# Altium schematic sheet PM12_P1V8.SchDoc: FIT_PM12 board
size 420 x 297 mm; CheckedBy: G.Kasprowicz; Author: INR Moscow; CompanyName: WUT ISE; DrawnBy: M.Podgórski; Organization: WUT ISE; Address1: PW ISE; Address2: Nowowiejska 15/19 00-665 Warsaw; Address3: gkasprow@gmail.com; DocumentNumber: 20; Revision: 2; SheetNumber: 21; SheetTotal: 34; ModifiedBy: -; CheckedDate: -; Title2: P1V8 PSU; DivGrp: WUT ISE; Designer: INR RAS; ModifiedDate: -; ProjectName: Sensor Box
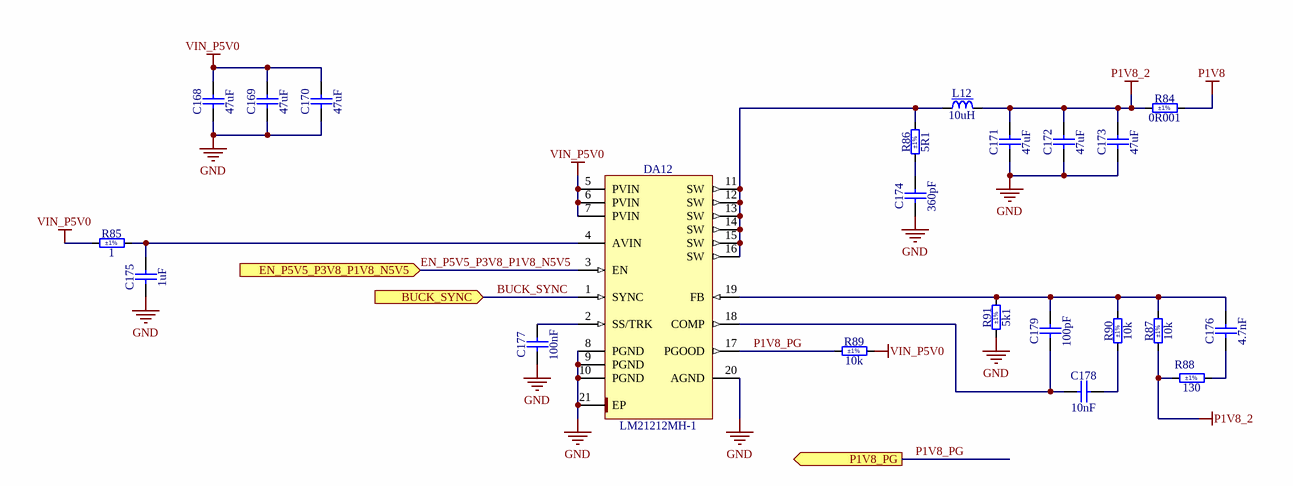
[diagram p0: PM12_P1V8.SchDoc]

## Parts
C168  47uF  [CAPC3225X270N]
C169  47uF  [CAPC3225X270N]
C170  47uF  [CAPC3225X270N]
C171  47uF  [CAPC3225X270N]
C172  47uF  [CAPC3225X270N]
C173  47uF  [CAPC3225X270N]
C174  360pF  [CAPC2013X145N]
C175  1uF  [CAPC2012X140N]
C176  4.7nF  [CAPC2012X135N]
C177  100nF  [CAPC2012X135N]
C178  10nF  [CAPC2012X135N]
C179  100pF  [CAPC2012X135N]
DA12  LM21212MH-1  [TEXAS_PWP0020AA]
L12  10uH  [IND_VISHAY_IHPL4040DZ-01]
R84  0R001  Tolerance: ±1%  [RESC_BOURNS_CRE2512_0R001-0R004]
R85  1  Tolerance: ±1%  [RESC2012X60N]
R86  5R1  Tolerance: ±1%  [RESC2012X60N]
R87  10k  Tolerance: ±1%  [RESC2012X60N]
R88  130  Tolerance: ±1%  [RESC2012X60N]
R89  10k  Tolerance: ±1%  [RESC2012X60N]
R90  10k  Tolerance: ±1%  [RESC2012X60N]
R91  5k1  Tolerance: ±1%  [RESC2012X60N]

## Ports
BUCK_SYNC (in), EN_P5V5_P3V8_P1V8_N5V5 (in), P1V8_PG (out)

## Nets
GND: C168.1 C169.1 C170.1 C171.1 C172.1 C173.1 C174.1 C175.1 C177.1 DA12.8(PGND) DA12.9(PGND) DA12.10(PGND) DA12.20(AGND) DA12.21(EP) R91.1
P1V8: R84.2
P1V8_2: C171.2 C172.2 C173.2 L12.2 R84.1 R87.1 R88.2
VIN_P5V0: C168.2 C169.2 C170.2 DA12.5(PVIN) DA12.6(PVIN) DA12.7(PVIN) R85.1 R89.2
BUCK_SYNC: DA12.1(SYNC) ; port BUCK_SYNC
EN_P5V5_P3V8_P1V8_N5V5: DA12.3(EN) ; port EN_P5V5_P3V8_P1V8_N5V5
P1V8_PG: DA12.17(PGOOD) R89.1 ; port P1V8_PG
NetC174_2: C174.2 R86.1
NetC175_2: C175.2 DA12.4(AVIN) R85.2
NetC176_1: C176.1 R88.1
NetC176_2: C176.2 C179.2 DA12.19(FB) R87.2 R90.2 R91.2
NetC177_2: C177.2 DA12.2(SS/TRK)
NetC178_1: C178.1 R90.1
NetC178_2: C178.2 C179.1 DA12.18(COMP)
NetDA12_11: DA12.11(SW) DA12.12(SW) DA12.13(SW) DA12.14(SW) DA12.15(SW) DA12.16(SW) L12.1 R86.2

## Notes on the sheet
- Project/Equipment
- Document
- Designer
- Drawn by
- Check.by
- Copyright WUT ISE 2024.
  This documentation describes Open Hardware and is licensed under the CERN OHL v.2. You may redistribute and modify this documentation under the terms of the CERN OHL v.2. (http://ohwr.org/CERNOHL). This documentation is distributed WITHOUT ANY EXPRESS OR IMPLIED WARRANTY, INCLUDING OF MERCHANTABILITY, SATISFACTORY QUALITY AND FITNESS FOR A PARTICULAR PURPOSE. Please see the CERN OHL v.2 for applicable conditions.
- Contact
- File
- Last Mod.
- Print Date
- Sheet
- Size
- A3
- of
- Rev

## Library data of the parts
C168-C173 = CC1210_47UF_16V_20%_X5R: Non-polarised capacitor; Part Description: SMD Multilayer Chip Ceramic Capacitor; Manufacturer: GENERIC; Manufacturer1 Part Number: EMK325BJ476MM-T; Voltage: 16V; TC: X5R; Tolerance: ±20%; Part Number: CC1210_47UF_16V_20%_X5R; Component Kind: Standard; Component Type: Standard; Pin Count: 2; Value: 47uF; Status: None; Manufacturer Part Number: CC1210_47UF_16V_20%_X5R; Case: 1210; Mounted: Yes; Socket: No; SMD: Yes; Sense: No; Manufacturer1 Example: TAIYO YUDEN; Manufacturer1 ComponentHeight: 2.7mm; HelpURL: \\cern.ch\dfs\Applications\Altium\Datasheets\CC1210_X5R_TAIYO-YUDEN_HIGH-VALUE.pdf; Author: CERN DEM MR; CreateDate: 03.02.2016; LatestRevisionDate: 03.02.2016
C174 = CC0805_360PF_50V_5%_C0G: Non-polarised capacitor; Part Description: SMD Multilayer Chip Ceramic Capacitor; Manufacturer: GENERIC; Manufacturer1 Part Number: CC0805JRNPO9BN361; Voltage: 50V; TC: NP0; Tolerance: ±5%; Part Number: CC0805_360PF_50V_5%_C0G; Component Kind: Standard; Component Type: Standard; Pin Count: 2; Value: 360pF; Status: None; Manufacturer Part Number: CC0805_360PF_50V_5%_C0G; Case: 0805; Mounted: Yes; Socket: No; SMD: Yes; Sense: No; Manufacturer1 Example: YAGEO PHYCOMP; Manufacturer1 ComponentHeight: 1.45mm; HelpURL: \\cern.ch\dfs\Applications\Altium\Datasheets\CC0805_NP0_YAGEO.pdf; Author: CERN DEM HF; CreateDate: 30.05.2024; LatestRevisionDate: 30.05.2024
C175 = CC0805_1UF_25V_10%_X7R: Non-polarised capacitor; Part Description: SMD Multilayer Chip Ceramic Capacitor; Manufacturer: GENERIC; Manufacturer1 Part Number: C0805C105K3RAC; Voltage: 25V; TC: X7R; Tolerance: ±10%; Part Number: CC0805_1UF_25V_10%_X7R; Component Kind: Standard; Component Type: Standard; Pin Count: 2; Value: 1uF; Status: Preferred; Manufacturer Part Number: CC0805_1UF_25V_10%_X7R; Case: 0805; Mounted: Yes; Socket: No; SMD: Yes; Sense: No; Manufacturer1 Example: KEMET; Manufacturer1 ComponentHeight: 1.4mm; HelpURL: \\cern.ch\dfs\Applications\Altium\Datasheets\CC0805_X7R_KEMET.pdf; Author: CERN DEM JLC; CreateDate: 23.03.2009; LatestRevisionDate: 23.03.2009
C176 = CC0805_4.7NF_50V_10%_X7R: Non-polarised capacitor; Part Description: SMD Multilayer Chip Ceramic Capacitor; Manufacturer: GENERIC; Manufacturer1 Part Number: 223858615632; Voltage: 50V; TC: X7R; Tolerance: ±10%; Part Number: CC0805_4.7NF_50V_10%_X7R; Component Kind: Standard; Component Type: Standard; Pin Count: 2; Value: 4.7nF; Status: Preferred; Manufacturer Part Number: CC0805_4.7NF_50V_10%_X7R; Case: 0805; Mounted: Yes; Socket: No; SMD: Yes; Sense: No; Manufacturer1 Example: PHYCOMP; Manufacturer1 ComponentHeight: 0.94mm; HelpURL: \\cern.ch\dfs\Applications\Altium\Datasheets\CC0805_X7R_PHYCOMP.pdf; Author: CERN DEM JLC; CreateDate: 03.12.2007; LatestRevisionDate: 03.12.2007
C177 = CC0805_100NF_50V_10%_X7R: Non-polarised capacitor; Part Description: SMD Multilayer Chip Ceramic Capacitor; Manufacturer: GENERIC; Manufacturer1 Part Number: C2012X7R1H104K085; Voltage: 50V; TC: X7R; Tolerance: ±10%; Part Number: CC0805_100NF_50V_10%_X7R; Component Kind: Standard; Component Type: Standard; Pin Count: 2; Value: 100nF; Status: None; Manufacturer Part Number: CC0805_100NF_50V_10%_X7R; Case: 0805; Mounted: Yes; Socket: No; SMD: Yes; Sense: No; Manufacturer1 Example: TDK; Manufacturer1 ComponentHeight: 1mm; HelpURL: \\cern.ch\dfs\Applications\Altium\Datasheets\CC0805_X7R_TDK_C.pdf; Author: CERN DEM JLC; CreateDate: 03.12.2007; LatestRevisionDate: 22.04.2015
C178 = CC0805_10NF_50V_10%_X7R: Non-polarised capacitor; Part Description: SMD Multilayer Chip Ceramic Capacitor; Manufacturer: GENERIC; Manufacturer1 Part Number: C0805C103K5RACTU; Voltage: 50V; TC: X7R; Tolerance: ±10%; Part Number: CC0805_10NF_50V_10%_X7R; Component Kind: Standard; Component Type: Standard; Pin Count: 2; Value: 10nF; Status: Preferred; Manufacturer Part Number: CC0805_10NF_50V_10%_X7R; Case: 0805; Mounted: Yes; Socket: No; SMD: Yes; Sense: No; Manufacturer1 Example: KEMET; Manufacturer1 ComponentHeight: 0.88mm; HelpURL: \\cern.ch\dfs\Applications\Altium\Datasheets\CC0805_X7R_KEMET.pdf; Author: CERN DEM JLC; CreateDate: 03.12.2007; LatestRevisionDate: 22.04.2015
C179 = CC0805_100PF_50V_5%_NP0: Non-polarised capacitor; Part Description: SMD Multilayer Chip Ceramic Capacitor; Manufacturer: GENERIC; Manufacturer1 Part Number: 223886115101; Voltage: 50V; TC: C0G/NP0; Tolerance: ±5%; Part Number: CC0805_100PF_50V_5%_NP0; Component Kind: Standard; Component Type: Standard; Pin Count: 2; Value: 100pF; Status: Preferred; Manufacturer Part Number: CC0805_100PF_50V_5%_NP0; Case: 0805; Mounted: Yes; Socket: No; SMD: Yes; Sense: No; Manufacturer1 Example: PHYCOMP; Manufacturer1 ComponentHeight: 1.35mm; HelpURL: \\cern.ch\dfs\Applications\Altium\Datasheets\CC0805_NP0_PHYCOMP.pdf; Author: CERN DEM JLC; CreateDate: 03.12.2007; LatestRevisionDate: 03.12.2007
DA12 = LM21212MH-1: 2.95-V To 5.5-V, 12-A, Voltage-Mode Synchronous Buck Regulator with Frequency Synchronization; Manufacturer: TEXAS INSTRUMENTS; PressFit: No; Bonding: No; Part Number: LM21212MH-1; Component Kind: Standard; Component Type: Standard; Device: LM21212MH-1; PackageDescription: TEXAS Case Style PWP0020AA, SOP, 0.65mm Pitch; 20 Pin, 4.40mm W X 6.50mm L X 1.10mm H body (w/thermal tab 3.4mm X 4.6mm  ), IPC Medium Density; Part Description: 2.95-V To 5.5-V, 12-A, Voltage-Mode Synchronous Buck Regulator with Frequency Synchronization; Manufacturer Part Number: LM21212MH-1; Pin Count: 21; Case: TSSOP20; Mounted: Yes; Socket: No; SMD: Yes; Sense: No; ComponentHeight: 1.1mm; HelpURL: \\cern.ch\dfs\Applications\Altium\Datasheets\LM21212MH-1.pdf; Author: CERN DEM HF; CreateDate: 05.06.2024; LatestRevisionDate: 05.06.2024
L12 = IND4040_10UH_20%_VISHAY_IHLP-4040DZ-01: Inductor With Core; Part Description: IHLP® Commercial Inductor, Low DCR Series; Manufacturer: VISHAY DALE; Manufacturer Part Number: IHLP4040DZER100M01; Power: 6.8A; Resistance: 0.0332R; Tolerance: ±20%; Part Number: IND4040_10UH_20%_VISHAY_IHLP-4040DZ-01; Component Kind: Standard; Component Type: Standard; Pin Count: 2; Value: 10uH; Case: 4040; Mounted: Yes; Socket: No; SMD: Yes; Sense: No; ComponentHeight: 4mm; HelpURL: \\cern.ch\dfs\Applications\Altium\Datasheets\IND_VISHAY_IHLP4040DZ-01.pdf; Author: CERN DEM HF; CreateDate: 31.05.2024; LatestRevisionDate: 31.05.2024
R84 = R2512_0R001_1%_3W_50PPM_BOURNS_CRE2512: Resistor - 1%; Part Description: High Power Current Sense Chip Resistor; Manufacturer: BOURNS; Manufacturer Part Number: CRE2512-FZ-R001E-3; Power: 3W; TC: ±50ppm/°C; PressFit: No; Part Number: R2512_0R001_1%_3W_50PPM_BOURNS_CRE2512; Component Kind: Standard; Component Type: Standard; Pin Count: 2; Value: 0R001; Status: None; Case: 2512; Mounted: Yes; Sense: No; Socket: No; SMD: Yes; ComponentHeight: 0.9mm; HelpURL: \\cern.ch\dfs\Applications\Altium\Datasheets\R2512_BOURNS_CRE2512.pdf; Author: CERN DEM BC; CreateDate: 13.10.2021; LatestRevisionDate: 13.10.2021
R85 = R0805_1R_1%_0.125W_100PPM: Resistor - 1%; Part Description: Thick Film Chip Resistor; Manufacturer: GENERIC; Manufacturer1 Part Number: CRCW08051R00FKEA; Power: 0.125W; TC: ±100ppm/°C; PressFit: No; Part Number: R0805_1R_1%_0.125W_100PPM; Component Kind: Standard; Component Type: Standard; Pin Count: 2; Value: 1; Status: None; Manufacturer Part Number: R0805_1R_1%_0.125W_100PPM; Case: 0805; Mounted: Yes; Sense: No; Socket: No; SMD: Yes; Manufacturer1 Example: VISHAY; Manufacturer1 ComponentHeight: 0.6mm; HelpURL: \\cern.ch\dfs\Applications\Altium\Datasheets\R0805_VISHAY_CRCW e3.pdf; Author: CERN DEM HF; CreateDate: 07.06.2024; LatestRevisionDate: 07.06.2024
R86 = R0805_5R1_1%_0.125W_100PPM: Resistor - 1%; Part Description: Thick Film Chip Resistor; Manufacturer: GENERIC; Manufacturer1 Part Number: CRCW08055R10FKEAHP; Power: 0.125W; TC: ±100ppm/°C; PressFit: No; Part Number: R0805_5R1_1%_0.125W_100PPM; Component Kind: Standard; Component Type: Standard; Pin Count: 2; Value: 5R1; Status: None; Manufacturer Part Number: R0805_5R1_1%_0.125W_100PPM; Case: 0805; Mounted: Yes; Sense: No; Socket: No; SMD: Yes; Manufacturer1 Example: VISHAY; Manufacturer1 ComponentHeight: 0.6mm; HelpURL: \\cern.ch\dfs\Applications\Altium\Datasheets\R0805_VISHAY_CRCW-HP e3.pdf; Author: CERN DEM HF; CreateDate: 07.06.2024; LatestRevisionDate: 07.06.2024
R87 R89 R90 = R0805_10K_1%_0.125W_100PPM: Resistor - 1%; Part Description: General Purpose Thick Film Chip Resistor; Manufacturer: GENERIC; Manufacturer1 Part Number: NRC10F1002TRF; Power: 0.125W; TC: ±100ppm/°C; PressFit: No; Part Number: R0805_10K_1%_0.125W_100PPM; Component Kind: Standard; Component Type: Standard; Pin Count: 2; Value: 10k; Status: Preferred; Manufacturer Part Number: R0805_10K_1%_0.125W_100PPM; Case: 0805; Mounted: Yes; Sense: No; Socket: No; SMD: Yes; Manufacturer1 Example: NIC COMPONENT; Manufacturer1 ComponentHeight: 0.6mm; HelpURL: \\cern.ch\dfs\Applications\Altium\Datasheets\R0805_NIC_NRC.pdf; Author: CERN DEM JLC; CreateDate: 03.12.2007; LatestRevisionDate: 13.03.2008
R88 = R0805_130R_1%_0.125W_100PPM: Resistor - 1%; Part Description: General Purpose Thick Film Chip Resistor; Manufacturer: GENERIC; Manufacturer1 Part Number: NRC10F1300TRF; Power: 0.125W; TC: ±100ppm/°C; PressFit: No; Part Number: R0805_130R_1%_0.125W_100PPM; Component Kind: Standard; Component Type: Standard; Pin Count: 2; Value: 130; Status: Preferred; Manufacturer Part Number: R0805_130R_1%_0.125W_100PPM; Case: 0805; Mounted: Yes; Sense: No; Socket: No; SMD: Yes; Manufacturer1 Example: NIC COMPONENT; Manufacturer1 ComponentHeight: 0.6mm; HelpURL: \\cern.ch\dfs\Applications\Altium\Datasheets\R0805_NIC_NRC.pdf; Author: CERN DEM JLC; CreateDate: 03.12.2007; LatestRevisionDate: 13.03.2008
R91 = R0805_5K1_1%_0.125W_100PPM: Resistor - 1%; Part Description: General Purpose Thick Film Chip Resistor; Manufacturer: GENERIC; Manufacturer1 Part Number: NRC10F5101TRF; Power: 0.125W; TC: ±100ppm/°C; PressFit: No; Part Number: R0805_5K1_1%_0.125W_100PPM; Component Kind: Standard; Component Type: Standard; Pin Count: 2; Value: 5k1; Status: Preferred; Manufacturer Part Number: R0805_5K1_1%_0.125W_100PPM; Case: 0805; Mounted: Yes; Sense: No; Socket: No; SMD: Yes; Manufacturer1 Example: NIC COMPONENT; Manufacturer1 ComponentHeight: 0.6mm; HelpURL: \\cern.ch\dfs\Applications\Altium\Datasheets\R0805_NIC_NRC.pdf; Author: CERN DEM JLC; CreateDate: 03.12.2007; LatestRevisionDate: 13.03.2008